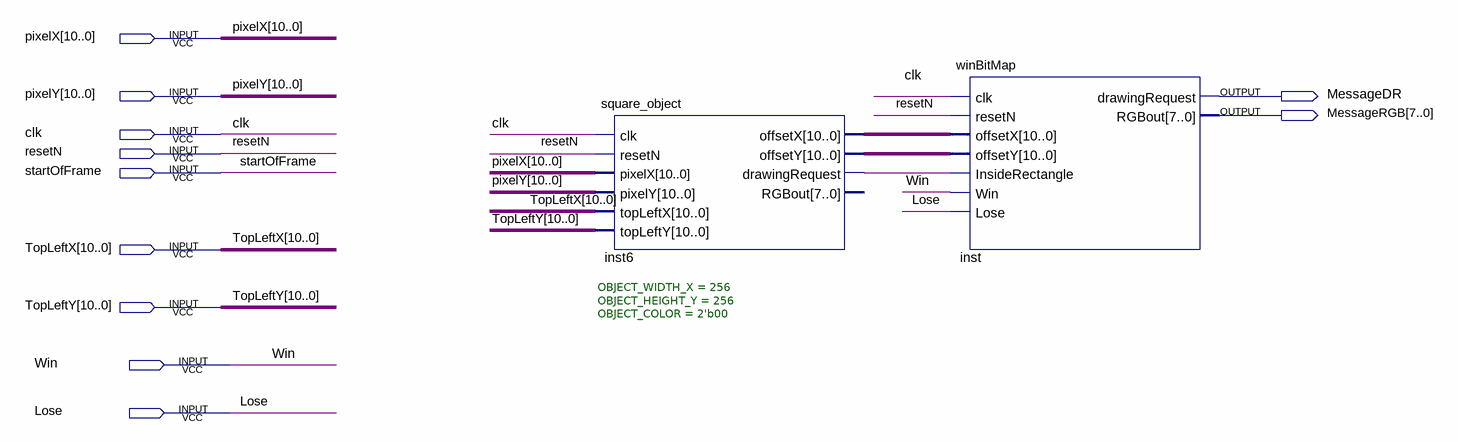
[diagram p0: schematic sheet]
// Quartus schematic MessageBlock.bdf as structural Verilog: 2 symbols, 11 pins
module MessageBlock (
  input  [10:0] pixelX,
  input  [10:0] pixelY,
  input  clk,
  input  resetN,
  input  startOfFrame,
  input  [10:0] TopLeftX,
  input  [10:0] TopLeftY,
  input  Win,
  input  Lose,
  output MessageDR,
  output [7:0] MessageRGB
);

  wire inst6_drawingrequest;
  wire [10:0] inst6_offsetx, inst6_offsety;

  square_object #(.OBJECT_WIDTH_X(256), .OBJECT_HEIGHT_Y(256), .OBJECT_COLOR(2'b00)) inst6 (
    .clk(clk), .resetN(resetN), .pixelX(pixelX), .pixelY(pixelY), .topLeftX(TopLeftX), .topLeftY(TopLeftY),
    .offsetX(inst6_offsetx), .offsetY(inst6_offsety), .drawingRequest(inst6_drawingrequest));  // open: RGBout
  winBitMap inst (
    .clk(clk), .resetN(resetN), .offsetX(inst6_offsetx), .offsetY(inst6_offsety),
    .InsideRectangle(inst6_drawingrequest), .Win(Win), .Lose(Lose), .drawingRequest(MessageDR),
    .RGBout(MessageRGB));
endmodule
